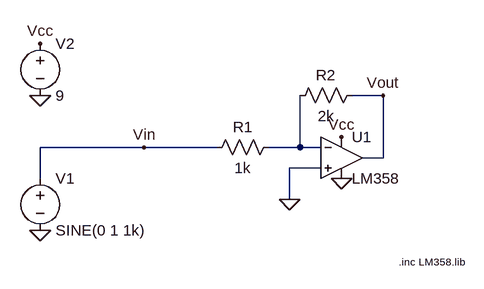
[diagram p0: schematic OPAMP.asc]
OPAMP.asc, the LTspice schematic file:
Version 4
SHEET 1 880 680
WIRE 416 96 368 96
WIRE 48 176 -112 176
WIRE 160 176 48 176
WIRE 288 176 288 96
WIRE 288 176 240 176
WIRE 320 176 288 176
WIRE 416 192 416 96
WIRE 416 192 384 192
WIRE 320 208 272 208
WIRE -112 224 -112 176
WIRE 272 256 272 208
FLAG -112 96 0
FLAG -112 304 0
FLAG 272 256 0
FLAG -112 16 Vcc
FLAG 352 160 Vcc
FLAG 352 224 0
FLAG 48 176 Vin
FLAG 416 96 Vout
SYMBOL res 256 160 R90
WINDOW 0 0 56 VBottom 2
WINDOW 3 32 56 VTop 2
SYMATTR InstName R1
SYMATTR Value 1k
SYMBOL res 384 80 R90
WINDOW 0 0 56 VBottom 2
WINDOW 3 32 56 VTop 2
SYMATTR InstName R2
SYMATTR Value 2k
SYMBOL Opamps\\opamp2 352 128 R0
SYMATTR InstName U1
SYMATTR Value LM358
SYMBOL voltage -112 208 R0
WINDOW 123 0 0 Left 0
WINDOW 39 0 0 Left 0
SYMATTR InstName V1
SYMATTR Value SINE(0 1 1k)
SYMBOL voltage -112 0 R0
WINDOW 123 0 0 Left 0
WINDOW 39 0 0 Left 0
SYMATTR InstName V2
SYMATTR Value 9
TEXT 440 352 Left 1 !.inc LM358.lib

The netlist it stands for:
* OPAMP.asc
R1 N001 Vin 1k
R2 Vout N001 2k
XU1 0 N001 Vcc 0 Vout LM358  ; pins In+ In- V+ V- OUT
V1 Vin 0 SINE(0 1 1k)
V2 Vcc 0 9
.inc LM358.lib
.backanno
.end